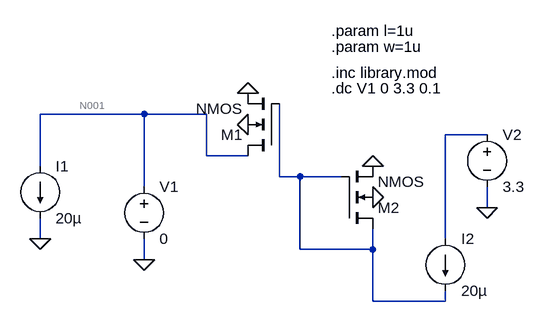
[diagram p0: schematic quiz5.asc]
quiz5.asc, the LTspice schematic file:
Version 4
SHEET 1 880 680
WIRE 176 48 16 48
WIRE 272 48 176 48
WIRE 704 80 640 80
WIRE 272 112 272 48
WIRE 336 112 272 112
WIRE 16 128 16 48
WIRE 384 144 384 32
WIRE 416 144 384 144
WIRE 480 144 416 144
WIRE 176 160 176 48
WIRE 704 192 704 160
WIRE 16 240 16 208
WIRE 640 240 640 80
WIRE 416 256 416 144
WIRE 528 256 528 224
WIRE 528 256 416 256
WIRE 176 272 176 240
WIRE 528 336 528 256
WIRE 640 336 640 320
WIRE 640 336 528 336
FLAG 16 240 0
FLAG 176 272 0
FLAG 704 192 0
FLAG 336 16 0
FLAG 528 128 0
FLAG 528 176 0
FLAG 336 64 0
SYMBOL current 16 128 R0
WINDOW 123 0 0 Left 0
WINDOW 39 0 0 Left 0
SYMATTR InstName I1
SYMATTR Value 20µ
SYMBOL voltage 176 144 R0
WINDOW 123 0 0 Left 0
WINDOW 39 0 0 Left 0
SYMATTR InstName V1
SYMATTR Value 0
SYMBOL voltage 704 64 R0
WINDOW 123 0 0 Left 0
WINDOW 39 0 0 Left 0
SYMATTR InstName V2
SYMATTR Value 3.3
SYMBOL nmos4 384 112 R180
SYMATTR InstName M1
SYMATTR Value2 l=l w=w
SYMBOL nmos4 480 224 M180
SYMATTR InstName M2
SYMATTR Value2 l=l w=w
SYMBOL current 640 240 R0
WINDOW 123 0 0 Left 0
WINDOW 39 0 0 Left 0
SYMATTR InstName I2
SYMATTR Value 20µ
TEXT 464 -16 Left 2 !.inc library.mod
TEXT 464 8 Left 2 !.dc V1 0 3.3 0.1
TEXT 464 -80 Left 2 !.param l=1u
TEXT 464 -56 Left 2 !.param w=1u

The netlist it stands for:
* quiz5.asc
I1 N001 0 20µ
V1 N001 0 0
V2 N002 0 3.3
M1 N001 N003 0 0 NMOS l=l w=w
M2 N003 N003 0 0 NMOS l=l w=w
I2 N002 N003 20µ
.model NMOS NMOS
.model PMOS PMOS
.lib standard.mos
.inc library.mod
.dc V1 0 3.3 0.1
.param l=1u
.param w=1u
.backanno
.end

* Results of the author's LTspice run, read from the files saved beside the schematic
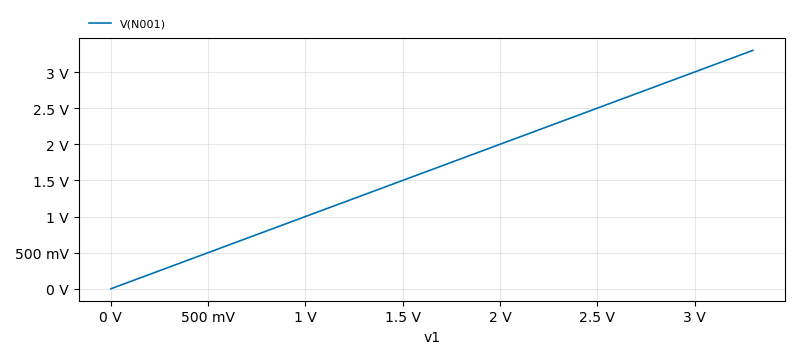
[diagram p1: DC transfer characteristic of quiz5.asc, plotted from the saved traces]
* DC transfer characteristic, 1 run:
*   V(N001): 0 V at v1=0 V, 3.3 V at v1=3.3 V, min 0 V, max 3.3 V